# Altium project PCB_Project.PrjPcb (part 5 of 5)
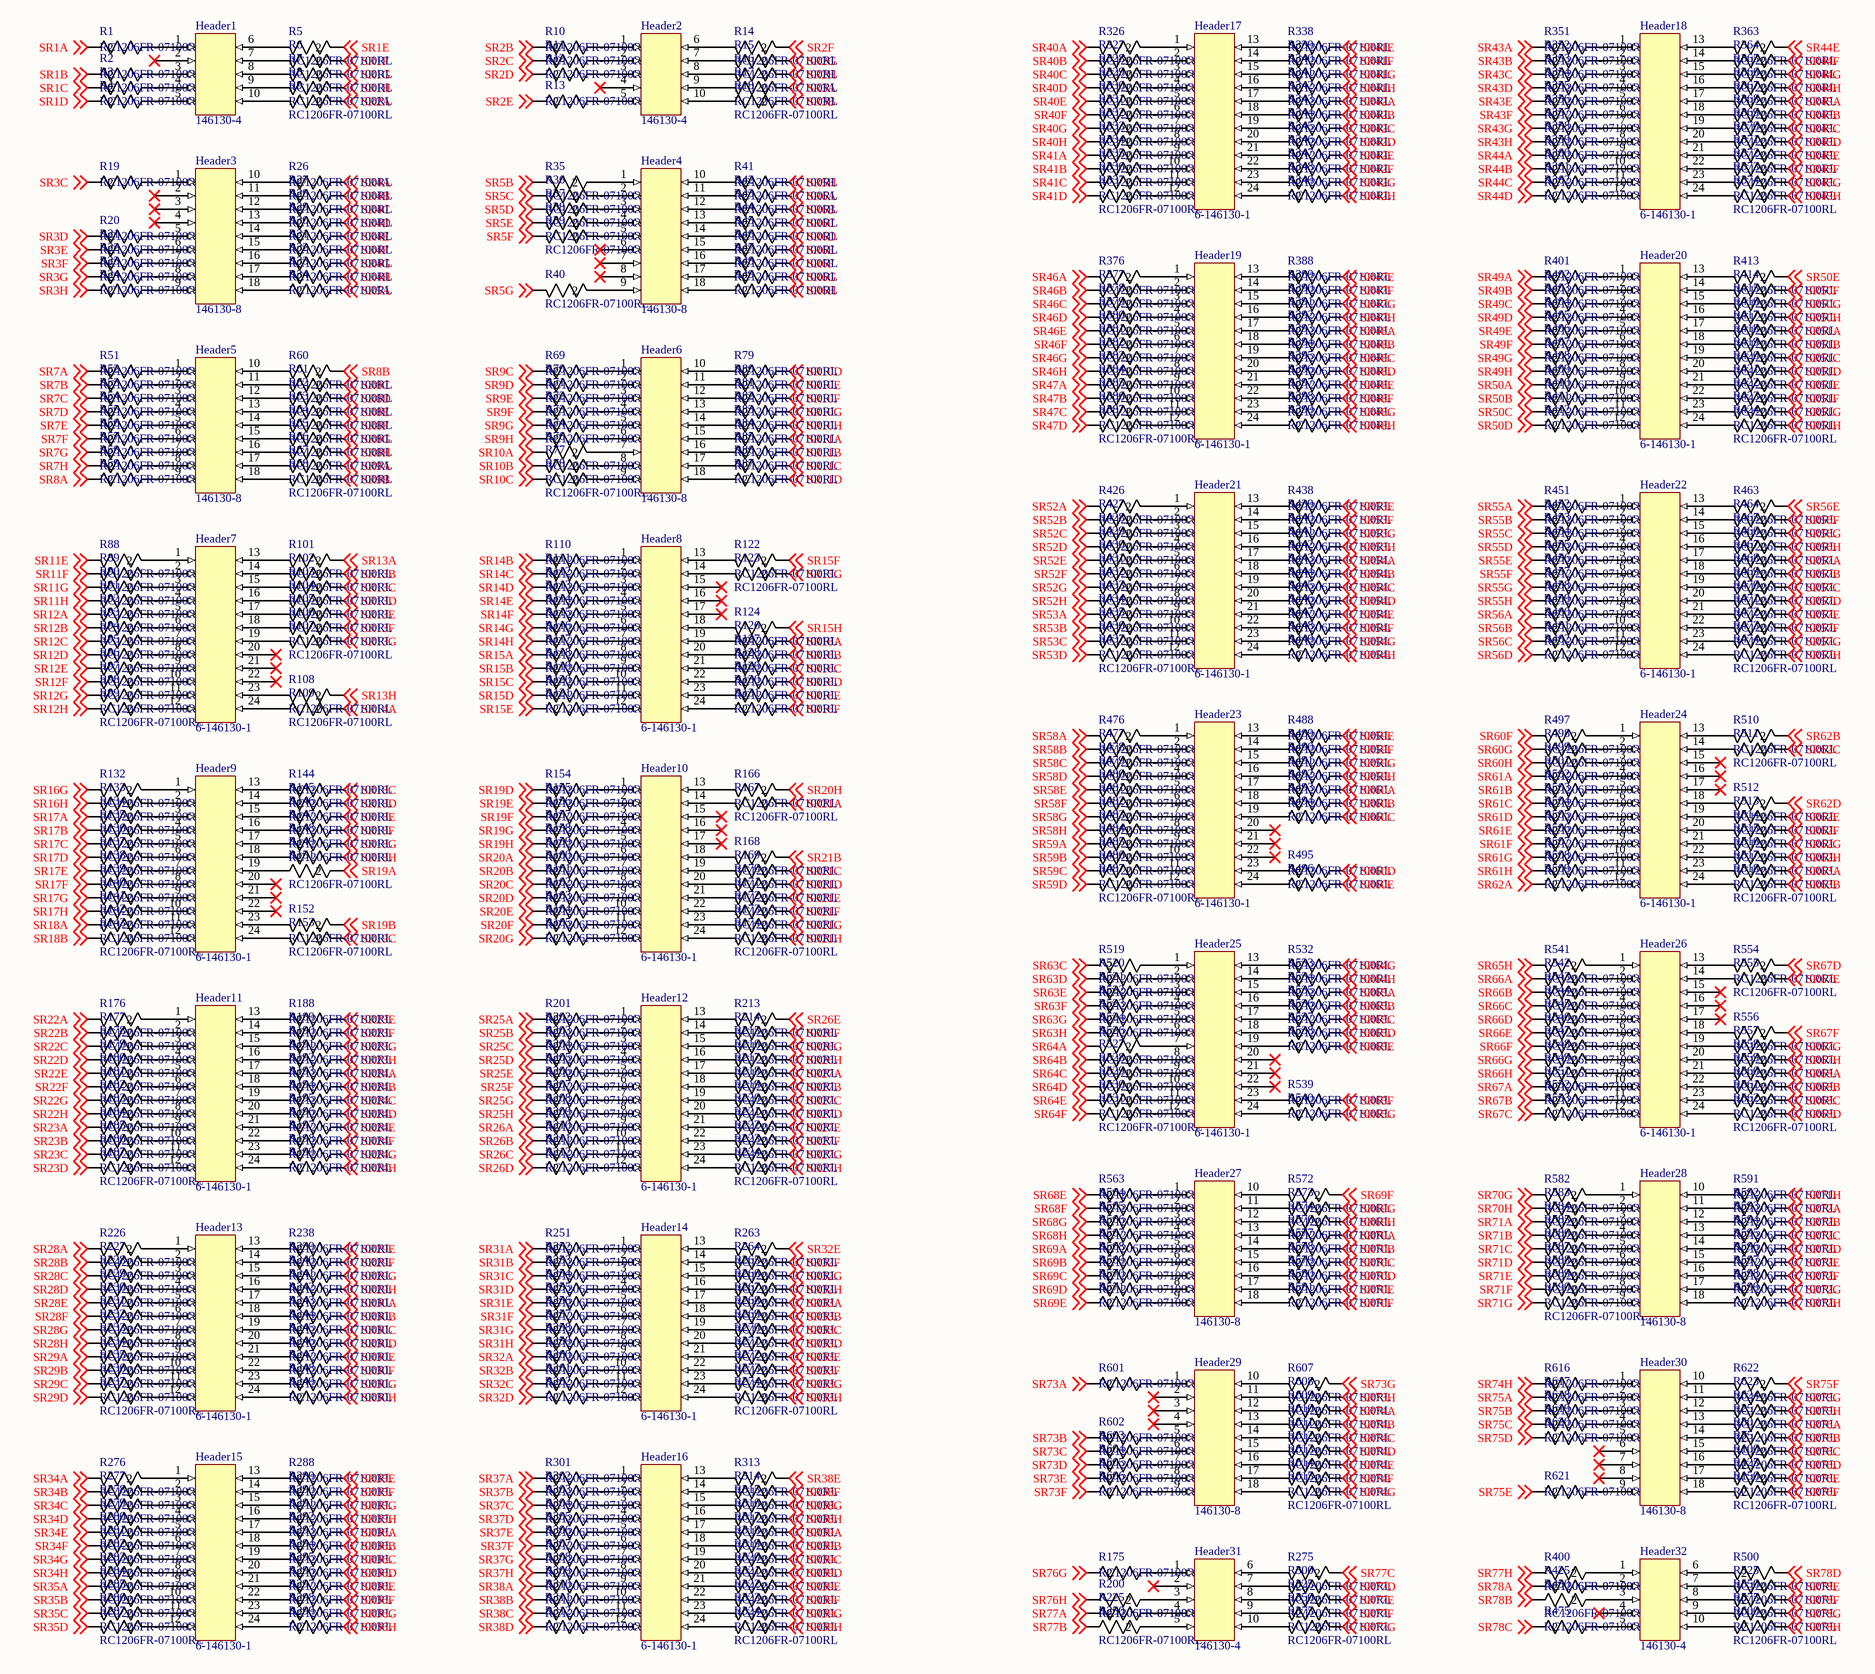
[diagram p10: digital_PIN_interface.SchDoc]

## Nets that join several sheets
SR1A: main (SER1.15), digital_PIN_interface (R1.2)
SR1B: main (SER1.1), digital_PIN_interface (R2.2)
SR1C: main (SER1.2), digital_PIN_interface (R3.2)
SR1D: main (SER1.3), digital_PIN_interface (R4.2)
SR1E: main (SER1.4), digital_PIN_interface (R5.2)
SR1F: main (SER1.5), digital_PIN_interface (R6.2)
SR1G: main (SER1.6), digital_PIN_interface (R7.2)
SR1H: main (SER1.7), digital_PIN_interface (R8.2)
SR2A: main (SER2.15), digital_PIN_interface (R9.2)
SR2B: main (SER2.1), digital_PIN_interface (R10.2)
SR2C: main (SER2.2), digital_PIN_interface (R11.2)
SR2D: main (SER2.3), digital_PIN_interface (R12.2)
SR2E: main (SER2.4), digital_PIN_interface (R13.2)
SR2F: main (SER2.5), digital_PIN_interface (R14.2)
SR2G: main (SER2.6), digital_PIN_interface (R15.2)
SR2H: main (SER2.7), digital_PIN_interface (R16.2)
SR3A: main (SER3.15), digital_PIN_interface (R17.2)
SR3B: main (SER3.1), digital_PIN_interface (R18.2)
SR3C: main (SER3.2), digital_PIN_interface (R19.2)
SR3D: main (SER3.3), digital_PIN_interface (R20.2)
SR3E: main (SER3.4), digital_PIN_interface (R21.2)
SR3F: main (SER3.5), digital_PIN_interface (R22.2)
SR3G: main (SER3.6), digital_PIN_interface (R23.2)
SR3H: main (SER3.7), digital_PIN_interface (R24.2)
SR4A: main (SER4.15), digital_PIN_interface (R26.1)
SR4B: main (SER4.1), digital_PIN_interface (R27.1)
SR4C: main (SER4.2), digital_PIN_interface (R28.1)
SR4D: main (SER4.3), digital_PIN_interface (R29.1)
SR4E: main (SER4.4), digital_PIN_interface (R30.1)
SR4F: main (SER4.5), digital_PIN_interface (R31.1)
SR4G: main (SER4.6), digital_PIN_interface (R32.1)
SR4H: main (SER4.7), digital_PIN_interface (R33.1)
SR5A: main (SER5.15), digital_PIN_interface (R34.1)
SR5B: main (SER5.1), digital_PIN_interface (R35.1)
SR5C: main (SER5.2), digital_PIN_interface (R36.1)
SR5D: main (SER5.3), digital_PIN_interface (R37.1)
SR5E: main (SER5.4), digital_PIN_interface (R38.1)
SR5F: main (SER5.5), digital_PIN_interface (R39.1)
SR5G: main (SER5.6), digital_PIN_interface (R40.1)
SR5H: main (SER5.7), digital_PIN_interface (R41.1)
SR6A: main (SER6.15), digital_PIN_interface (R42.1)
SR6B: main (SER6.1), digital_PIN_interface (R43.1)
SR6C: main (SER6.2), digital_PIN_interface (R44.1)
SR6D: main (SER6.3), digital_PIN_interface (R45.1)
SR6E: main (SER6.4), digital_PIN_interface (R46.1)
SR6F: main (SER6.5), digital_PIN_interface (R47.1)
SR6G: main (SER6.6), digital_PIN_interface (R48.1)
SR6H: main (SER6.7), digital_PIN_interface (R49.1)
SR7A: main (SER7.15), digital_PIN_interface (R51.2)
SR7B: main (SER7.1), digital_PIN_interface (R52.2)
SR7C: main (SER7.2), digital_PIN_interface (R53.2)
SR7D: main (SER7.3), digital_PIN_interface (R54.2)
SR7E: main (SER7.4), digital_PIN_interface (R55.2)
SR7F: main (SER7.5), digital_PIN_interface (R56.2)
SR7G: main (SER7.6), digital_PIN_interface (R57.2)
SR7H: main (SER7.7), digital_PIN_interface (R58.2)
SR8A: main (SER8.15), digital_PIN_interface (R59.2)
SR8B: main (SER8.1), digital_PIN_interface (R60.2)
SR8C: main (SER8.2), digital_PIN_interface (R61.2)
SR8D: main (SER8.3), digital_PIN_interface (R62.2)
SR8E: main (SER8.4), digital_PIN_interface (R63.2)
SR8F: main (SER8.5), digital_PIN_interface (R64.2)
SR8G: main (SER8.6), digital_PIN_interface (R65.2)
SR8H: main (SER8.7), digital_PIN_interface (R66.2)
SR9A: main (SER9.15), digital_PIN_interface (R67.2)
SR9B: main (SER9.1), digital_PIN_interface (R68.2)
SR9C: main (SER9.2), digital_PIN_interface (R69.2)
SR9D: main (SER9.3), digital_PIN_interface (R70.2)
SR9E: main (SER9.4), digital_PIN_interface (R71.2)
SR9F: main (SER9.5), digital_PIN_interface (R72.2)
SR9G: main (SER9.6), digital_PIN_interface (R73.2)
SR9H: main (SER9.7), digital_PIN_interface (R74.2)
SR10A: main (SER10.15), digital_PIN_interface (R76.1)
SR10B: main (SER10.1), digital_PIN_interface (R77.1)
SR10C: main (SER10.2), digital_PIN_interface (R78.1)
SR10D: main (SER10.3), digital_PIN_interface (R79.1)
SR10E: main (SER10.4), digital_PIN_interface (R80.1)
SR10F: main (SER10.5), digital_PIN_interface (R81.1)
SR10G: main (SER10.6), digital_PIN_interface (R82.1)
SR10H: main (SER10.7), digital_PIN_interface (R83.1)
SR11A: main (SER11.15), digital_PIN_interface (R84.1)
SR11B: main (SER11.1), digital_PIN_interface (R85.1)
SR11C: main (SER11.2), digital_PIN_interface (R86.1)
SR11D: main (SER11.3), digital_PIN_interface (R87.1)
SR11E: main (SER11.4), digital_PIN_interface (R88.1)
SR11F: main (SER11.5), digital_PIN_interface (R89.1)
SR11G: main (SER11.6), digital_PIN_interface (R90.1)
SR11H: main (SER11.7), digital_PIN_interface (R91.1)
SR12A: main (SER12.15), digital_PIN_interface (R92.1)
SR12B: main (SER12.1), digital_PIN_interface (R93.1)
SR12C: main (SER12.2), digital_PIN_interface (R94.1)
SR12D: main (SER12.3), digital_PIN_interface (R95.1)
SR12E: main (SER12.4), digital_PIN_interface (R96.1)
SR12F: main (SER12.5), digital_PIN_interface (R97.1)
SR12G: main (SER12.6), digital_PIN_interface (R98.1)
SR12H: main (SER12.7), digital_PIN_interface (R99.1)
SR13A: main (SER13.15), digital_PIN_interface (R101.2)
SR13B: main (SER13.1), digital_PIN_interface (R102.2)
SR13C: main (SER13.2), digital_PIN_interface (R103.2)
SR13D: main (SER13.3), digital_PIN_interface (R104.2)
SR13E: main (SER13.4), digital_PIN_interface (R105.2)
SR13F: main (SER13.5), digital_PIN_interface (R106.2)
SR13G: main (SER13.6), digital_PIN_interface (R107.2)
SR13H: main (SER13.7), digital_PIN_interface (R108.2)
SR14A: main (SER14.15), digital_PIN_interface (R109.2)
SR14B: main (SER14.1), digital_PIN_interface (R110.2)
SR14C: main (SER14.2), digital_PIN_interface (R111.2)
SR14D: main (SER14.3), digital_PIN_interface (R112.2)
SR14E: main (SER14.4), digital_PIN_interface (R113.2)
SR14F: main (SER14.5), digital_PIN_interface (R114.2)
SR14G: main (SER14.6), digital_PIN_interface (R115.2)
SR14H: main (SER14.7), digital_PIN_interface (R116.2)
SR15A: main (SER15.15), digital_PIN_interface (R117.2)
SR15B: main (SER15.1), digital_PIN_interface (R118.2)
SR15C: main (SER15.2), digital_PIN_interface (R119.2)
SR15D: main (SER15.3), digital_PIN_interface (R120.2)
SR15E: main (SER15.4), digital_PIN_interface (R121.2)
SR15F: main (SER15.5), digital_PIN_interface (R122.2)
SR15G: main (SER15.6), digital_PIN_interface (R123.2)
SR15H: main (SER15.7), digital_PIN_interface (R124.2)
SR16A: main (SER16.15), digital_PIN_interface (R126.1)
SR16B: main (SER16.1), digital_PIN_interface (R127.1)
SR16C: main (SER16.2), digital_PIN_interface (R128.1)
SR16D: main (SER16.3), digital_PIN_interface (R129.1)
SR16E: main (SER16.4), digital_PIN_interface (R130.1)
SR16F: main (SER16.5), digital_PIN_interface (R131.1)
SR16G: main (SER16.6), digital_PIN_interface (R132.1)
SR16H: main (SER16.7), digital_PIN_interface (R133.1)
SR17A: main (SER17.15), digital_PIN_interface (R134.1)
SR17B: main (SER17.1), digital_PIN_interface (R135.1)
SR17C: main (SER17.2), digital_PIN_interface (R136.1)
SR17D: main (SER17.3), digital_PIN_interface (R137.1)
SR17E: main (SER17.4), digital_PIN_interface (R138.1)
SR17F: main (SER17.5), digital_PIN_interface (R139.1)
SR17G: main (SER17.6), digital_PIN_interface (R140.1)
SR17H: main (SER17.7), digital_PIN_interface (R141.1)
SR18A: main (SER18.15), digital_PIN_interface (R142.1)
SR18B: main (SER18.1), digital_PIN_interface (R143.1)
SR18C: main (SER18.2), digital_PIN_interface (R144.1)
SR18D: main (SER18.3), digital_PIN_interface (R145.1)
SR18E: main (SER18.4), digital_PIN_interface (R146.1)
SR18F: main (SER18.5), digital_PIN_interface (R147.1)
SR18G: main (SER18.6), digital_PIN_interface (R148.1)
SR18H: main (SER18.7), digital_PIN_interface (R149.1)
SR19A: main (SER19.15), digital_PIN_interface (R151.2)
SR19B: main (SER19.1), digital_PIN_interface (R152.2)
SR19C: main (SER19.2), digital_PIN_interface (R153.2)
SR19D: main (SER19.3), digital_PIN_interface (R154.2)
SR19E: main (SER19.4), digital_PIN_interface (R155.2)
SR19F: main (SER19.5), digital_PIN_interface (R156.2)
SR19G: main (SER19.6), digital_PIN_interface (R157.2)
SR19H: main (SER19.7), digital_PIN_interface (R158.2)
SR20A: main (SER20.15), digital_PIN_interface (R159.2)
SR20B: main (SER20.1), digital_PIN_interface (R160.2)
SR20C: main (SER20.2), digital_PIN_interface (R161.2)
SR20D: main (SER20.3), digital_PIN_interface (R162.2)
SR20E: main (SER20.4), digital_PIN_interface (R163.2)
SR20F: main (SER20.5), digital_PIN_interface (R164.2)
SR20G: main (SER20.6), digital_PIN_interface (R165.2)
SR20H: main (SER20.7), digital_PIN_interface (R166.2)
SR21A: main (SER21.15), digital_PIN_interface (R167.2)
SR21B: main (SER21.1), digital_PIN_interface (R168.2)
SR21C: main (SER21.2), digital_PIN_interface (R169.2)
SR21D: main (SER21.3), digital_PIN_interface (R170.2)
SR21E: main (SER21.4), digital_PIN_interface (R171.2)
SR21F: main (SER21.5), digital_PIN_interface (R172.2)
SR21G: main (SER21.6), digital_PIN_interface (R173.2)
SR21H: main (SER21.7), digital_PIN_interface (R174.2)
SR22A: main (SER22.15), digital_PIN_interface (R176.1)
SR22B: main (SER22.1), digital_PIN_interface (R177.1)
SR22C: main (SER22.2), digital_PIN_interface (R178.1)
SR22D: main (SER22.3), digital_PIN_interface (R179.1)
SR22E: main (SER22.4), digital_PIN_interface (R180.1)
SR22F: main (SER22.5), digital_PIN_interface (R181.1)
SR22G: main (SER22.6), digital_PIN_interface (R182.1)
SR22H: main (SER22.7), digital_PIN_interface (R183.1)
SR23A: main (SER23.15), digital_PIN_interface (R184.1)
SR23B: main (SER23.1), digital_PIN_interface (R185.1)
SR23C: main (SER23.2), digital_PIN_interface (R186.1)
SR23D: main (SER23.3), digital_PIN_interface (R187.1)
SR23E: main (SER23.4), digital_PIN_interface (R188.1)
SR23F: main (SER23.5), digital_PIN_interface (R189.1)
SR23G: main (SER23.6), digital_PIN_interface (R190.1)
SR23H: main (SER23.7), digital_PIN_interface (R191.1)
SR24A: main (SER24.15), digital_PIN_interface (R192.1)
SR24B: main (SER24.1), digital_PIN_interface (R193.1)
SR24C: main (SER24.2), digital_PIN_interface (R194.1)
SR24D: main (SER24.3), digital_PIN_interface (R195.1)
SR24E: main (SER24.4), digital_PIN_interface (R196.1)
SR24F: main (SER24.5), digital_PIN_interface (R197.1)
SR24G: main (SER24.6), digital_PIN_interface (R198.1)
SR24H: main (SER24.7), digital_PIN_interface (R199.1)
SR25A: main (SER25.15), digital_PIN_interface (R201.2)
SR25B: main (SER25.1), digital_PIN_interface (R202.2)
SR25C: main (SER25.2), digital_PIN_interface (R203.2)
SR25D: main (SER25.3), digital_PIN_interface (R204.2)
SR25E: main (SER25.4), digital_PIN_interface (R205.2)
SR25F: main (SER25.5), digital_PIN_interface (R206.2)
SR25G: main (SER25.6), digital_PIN_interface (R207.2)
SR25H: main (SER25.7), digital_PIN_interface (R208.2)
SR26A: main (SER26.15), digital_PIN_interface (R209.2)
SR26B: main (SER26.1), digital_PIN_interface (R210.2)
SR26C: main (SER26.2), digital_PIN_interface (R211.2)
SR26D: main (SER26.3), digital_PIN_interface (R212.2)
SR26E: main (SER26.4), digital_PIN_interface (R213.2)
SR26F: main (SER26.5), digital_PIN_interface (R214.2)
SR26G: main (SER26.6), digital_PIN_interface (R215.2)
SR26H: main (SER26.7), digital_PIN_interface (R216.2)
SR27A: main (SER27.15), digital_PIN_interface (R217.2)
SR27B: main (SER27.1), digital_PIN_interface (R218.2)
SR27C: main (SER27.2), digital_PIN_interface (R219.2)
SR27D: main (SER27.3), digital_PIN_interface (R220.2)
SR27E: main (SER27.4), digital_PIN_interface (R221.2)
SR27F: main (SER27.5), digital_PIN_interface (R222.2)
SR27G: main (SER27.6), digital_PIN_interface (R223.2)
SR27H: main (SER27.7), digital_PIN_interface (R224.2)
SR28A: main (SER28.15), digital_PIN_interface (R226.1)
SR28B: main (SER28.1), digital_PIN_interface (R227.1)
SR28C: main (SER28.2), digital_PIN_interface (R228.1)
SR28D: main (SER28.3), digital_PIN_interface (R229.1)
SR28E: main (SER28.4), digital_PIN_interface (R230.1)
SR28F: main (SER28.5), digital_PIN_interface (R231.1)
SR28G: main (SER28.6), digital_PIN_interface (R232.1)
SR28H: main (SER28.7), digital_PIN_interface (R233.1)
SR29A: main (SER29.15), digital_PIN_interface (R234.1)
SR29B: main (SER29.1), digital_PIN_interface (R235.1)
SR29C: main (SER29.2), digital_PIN_interface (R236.1)
SR29D: main (SER29.3), digital_PIN_interface (R237.1)
SR29E: main (SER29.4), digital_PIN_interface (R238.1)
SR29F: main (SER29.5), digital_PIN_interface (R239.1)
SR29G: main (SER29.6), digital_PIN_interface (R240.1)
SR29H: main (SER29.7), digital_PIN_interface (R241.1)
SR30A: main (SER30.15), digital_PIN_interface (R242.1)
SR30B: main (SER30.1), digital_PIN_interface (R243.1)
SR30C: main (SER30.2), digital_PIN_interface (R244.1)
SR30D: main (SER30.3), digital_PIN_interface (R245.1)
SR30E: main (SER30.4), digital_PIN_interface (R246.1)
SR30F: main (SER30.5), digital_PIN_interface (R247.1)
SR30G: main (SER30.6), digital_PIN_interface (R248.1)
SR30H: main (SER30.7), digital_PIN_interface (R249.1)
SR31A: main (SER31.15), digital_PIN_interface (R251.2)
SR31B: main (SER31.1), digital_PIN_interface (R252.2)
SR31C: main (SER31.2), digital_PIN_interface (R253.2)
SR31D: main (SER31.3), digital_PIN_interface (R254.2)
SR31E: main (SER31.4), digital_PIN_interface (R255.2)
SR31F: main (SER31.5), digital_PIN_interface (R256.2)
SR31G: main (SER31.6), digital_PIN_interface (R257.2)
SR31H: main (SER31.7), digital_PIN_interface (R258.2)
SR32A: main (SER32.15), digital_PIN_interface (R259.2)
SR32B: main (SER32.1), digital_PIN_interface (R260.2)
SR32C: main (SER32.2), digital_PIN_interface (R261.2)
SR32D: main (SER32.3), digital_PIN_interface (R262.2)
SR32E: main (SER32.4), digital_PIN_interface (R263.2)
SR32F: main (SER32.5), digital_PIN_interface (R264.2)
SR32G: main (SER32.6), digital_PIN_interface (R265.2)
SR32H: main (SER32.7), digital_PIN_interface (R266.2)
SR33A: main (SER33.15), digital_PIN_interface (R267.2)
SR33B: main (SER33.1), digital_PIN_interface (R268.2)
SR33C: main (SER33.2), digital_PIN_interface (R269.2)
SR33D: main (SER33.3), digital_PIN_interface (R270.2)
SR33E: main (SER33.4), digital_PIN_interface (R271.2)
SR33F: main (SER33.5), digital_PIN_interface (R272.2)
SR33G: main (SER33.6), digital_PIN_interface (R273.2)
SR33H: main (SER33.7), digital_PIN_interface (R274.2)
SR34A: main (SER34.15), digital_PIN_interface (R276.1)
SR34B: main (SER34.1), digital_PIN_interface (R277.1)
SR34C: main (SER34.2), digital_PIN_interface (R278.1)
SR34D: main (SER34.3), digital_PIN_interface (R279.1)
SR34E: main (SER34.4), digital_PIN_interface (R280.1)
SR34F: main (SER34.5), digital_PIN_interface (R281.1)
SR34G: main (SER34.6), digital_PIN_interface (R282.1)
SR34H: main (SER34.7), digital_PIN_interface (R283.1)
SR35A: main (SER35.15), digital_PIN_interface (R284.1)
SR35B: main (SER35.1), digital_PIN_interface (R285.1)
SR35C: main (SER35.2), digital_PIN_interface (R286.1)
SR35D: main (SER35.3), digital_PIN_interface (R287.1)
SR35E: main (SER35.4), digital_PIN_interface (R288.1)
SR35F: main (SER35.5), digital_PIN_interface (R289.1)
SR35G: main (SER35.6), digital_PIN_interface (R290.1)
SR35H: main (SER35.7), digital_PIN_interface (R291.1)
SR36A: main (SER36.15), digital_PIN_interface (R292.1)
SR36B: main (SER36.1), digital_PIN_interface (R293.1)
SR36C: main (SER36.2), digital_PIN_interface (R294.1)
SR36D: main (SER36.3), digital_PIN_interface (R295.1)
SR36E: main (SER36.4), digital_PIN_interface (R296.1)
SR36F: main (SER36.5), digital_PIN_interface (R297.1)
SR36G: main (SER36.6), digital_PIN_interface (R298.1)
SR36H: main (SER36.7), digital_PIN_interface (R299.1)
SR37A: main (SER37.15), digital_PIN_interface (R301.2)
SR37B: main (SER37.1), digital_PIN_interface (R302.2)
SR37C: main (SER37.2), digital_PIN_interface (R303.2)
SR37D: main (SER37.3), digital_PIN_interface (R304.2)
SR37E: main (SER37.4), digital_PIN_interface (R305.2)
SR37F: main (SER37.5), digital_PIN_interface (R306.2)
SR37G: main (SER37.6), digital_PIN_interface (R307.2)
SR37H: main (SER37.7), digital_PIN_interface (R308.2)
SR38A: main (SER38.15), digital_PIN_interface (R309.2)
SR38B: main (SER38.1), digital_PIN_interface (R310.2)
SR38C: main (SER38.2), digital_PIN_interface (R311.2)
SR38D: main (SER38.3), digital_PIN_interface (R312.2)
SR38E: main (SER38.4), digital_PIN_interface (R313.2)
SR38F: main (SER38.5), digital_PIN_interface (R314.2)
SR38G: main (SER38.6), digital_PIN_interface (R315.2)
SR38H: main (SER38.7), digital_PIN_interface (R316.2)
SR39A: main (SER39.15), digital_PIN_interface (R317.2)
SR39B: main (SER39.1), digital_PIN_interface (R318.2)
SR39C: main (SER39.2), digital_PIN_interface (R319.2)
SR39D: main (SER39.3), digital_PIN_interface (R320.2)
SR39E: main (SER39.4), digital_PIN_interface (R321.2)
SR39F: main (SER39.5), digital_PIN_interface (R322.2)
SR39G: main (SER39.6), digital_PIN_interface (R323.2)
SR39H: main (SER39.7), digital_PIN_interface (R324.2)
SR40A: main (SER40.15), digital_PIN_interface (R326.1)
SR40B: main (SER40.1), digital_PIN_interface (R327.1)
SR40C: main (SER40.2), digital_PIN_interface (R328.1)
SR40D: main (SER40.3), digital_PIN_interface (R329.1)
SR40E: main (SER40.4), digital_PIN_interface (R330.1)
SR40F: main (SER40.5), digital_PIN_interface (R331.1)
SR40G: main (SER40.6), digital_PIN_interface (R332.1)
SR40H: main (SER40.7), digital_PIN_interface (R333.1)
SR41A: main (SER41.15), digital_PIN_interface (R334.1)
SR41B: main (SER41.1), digital_PIN_interface (R335.1)
SR41C: main (SER41.2), digital_PIN_interface (R336.1)
SR41D: main (SER41.3), digital_PIN_interface (R337.1)
SR41E: main (SER41.4), digital_PIN_interface (R338.1)
SR41F: main (SER41.5), digital_PIN_interface (R339.1)
SR41G: main (SER41.6), digital_PIN_interface (R340.1)
SR41H: main (SER41.7), digital_PIN_interface (R341.1)
SR42A: main (SER42.15), digital_PIN_interface (R342.1)
SR42B: main (SER42.1), digital_PIN_interface (R343.1)
SR42C: main (SER42.2), digital_PIN_interface (R344.1)
SR42D: main (SER42.3), digital_PIN_interface (R345.1)
SR42E: main (SER42.4), digital_PIN_interface (R346.1)
SR42F: main (SER42.5), digital_PIN_interface (R347.1)
SR42G: main (SER42.6), digital_PIN_interface (R348.1)
SR42H: main (SER42.7), digital_PIN_interface (R349.1)
SR43A: main (SER43.15), digital_PIN_interface (R351.2)
SR43B: main (SER43.1), digital_PIN_interface (R352.2)
SR43C: main (SER43.2), digital_PIN_interface (R353.2)
SR43D: main (SER43.3), digital_PIN_interface (R354.2)
SR43E: main (SER43.4), digital_PIN_interface (R355.2)
SR43F: main (SER43.5), digital_PIN_interface (R356.2)
SR43G: main (SER43.6), digital_PIN_interface (R357.2)
SR43H: main (SER43.7), digital_PIN_interface (R358.2)
SR44A: main (SER44.15), digital_PIN_interface (R359.2)
SR44B: main (SER44.1), digital_PIN_interface (R360.2)
SR44C: main (SER44.2), digital_PIN_interface (R361.2)
SR44D: main (SER44.3), digital_PIN_interface (R362.2)
SR44E: main (SER44.4), digital_PIN_interface (R363.2)
SR44F: main (SER44.5), digital_PIN_interface (R364.2)
SR44G: main (SER44.6), digital_PIN_interface (R365.2)
SR44H: main (SER44.7), digital_PIN_interface (R366.2)
SR45A: main (SER45.15), digital_PIN_interface (R367.2)
SR45B: main (SER45.1), digital_PIN_interface (R368.2)
SR45C: main (SER45.2), digital_PIN_interface (R369.2)
SR45D: main (SER45.3), digital_PIN_interface (R370.2)
SR45E: main (SER45.4), digital_PIN_interface (R371.2)
SR45F: main (SER45.5), digital_PIN_interface (R372.2)
SR45G: main (SER45.6), digital_PIN_interface (R373.2)
SR45H: main (SER45.7), digital_PIN_interface (R374.2)
SR46A: main (SER46.15), digital_PIN_interface (R376.1)
SR46B: main (SER46.1), digital_PIN_interface (R377.1)
SR46C: main (SER46.2), digital_PIN_interface (R378.1)
SR46D: main (SER46.3), digital_PIN_interface (R379.1)
SR46E: main (SER46.4), digital_PIN_interface (R380.1)
SR46F: main (SER46.5), digital_PIN_interface (R381.1)
SR46G: main (SER46.6), digital_PIN_interface (R382.1)
SR46H: main (SER46.7), digital_PIN_interface (R383.1)
SR47A: main (SER47.15), digital_PIN_interface (R384.1)
SR47B: main (SER47.1), digital_PIN_interface (R385.1)
SR47C: main (SER47.2), digital_PIN_interface (R386.1)
SR47D: main (SER47.3), digital_PIN_interface (R387.1)
SR47E: main (SER47.4), digital_PIN_interface (R388.1)
SR47F: main (SER47.5), digital_PIN_interface (R389.1)
SR47G: main (SER47.6), digital_PIN_interface (R390.1)
SR47H: main (SER47.7), digital_PIN_interface (R391.1)
SR48A: main (SER48.15), digital_PIN_interface (R392.1)
SR48B: main (SER48.1), digital_PIN_interface (R393.1)
SR48C: main (SER48.2), digital_PIN_interface (R394.1)
SR48D: main (SER48.3), digital_PIN_interface (R395.1)
SR48E: main (SER48.4), digital_PIN_interface (R396.1)
SR48F: main (SER48.5), digital_PIN_interface (R397.1)
SR48G: main (SER48.6), digital_PIN_interface (R398.1)
SR48H: main (SER48.7), digital_PIN_interface (R399.1)
SR49A: main (SER49.15), digital_PIN_interface (R401.2)
SR49B: main (SER49.1), digital_PIN_interface (R402.2)
SR49C: main (SER49.2), digital_PIN_interface (R403.2)
SR49D: main (SER49.3), digital_PIN_interface (R404.2)
SR49E: main (SER49.4), digital_PIN_interface (R405.2)
SR49F: main (SER49.5), digital_PIN_interface (R406.2)
SR49G: main (SER49.6), digital_PIN_interface (R407.2)
SR49H: main (SER49.7), digital_PIN_interface (R408.2)
SR50A: main (SER50.15), digital_PIN_interface (R409.2)
SR50B: main (SER50.1), digital_PIN_interface (R410.2)
SR50C: main (SER50.2), digital_PIN_interface (R411.2)
SR50D: main (SER50.3), digital_PIN_interface (R412.2)
SR50E: main (SER50.4), digital_PIN_interface (R413.2)
SR50F: main (SER50.5), digital_PIN_interface (R414.2)
SR50G: main (SER50.6), digital_PIN_interface (R415.2)
SR50H: main (SER50.7), digital_PIN_interface (R416.2)
SR51A: main (SER51.15), digital_PIN_interface (R417.2)
SR51B: main (SER51.1), digital_PIN_interface (R418.2)
SR51C: main (SER51.2), digital_PIN_interface (R419.2)
SR51D: main (SER51.3), digital_PIN_interface (R420.2)
SR51E: main (SER51.4), digital_PIN_interface (R421.2)
SR51F: main (SER51.5), digital_PIN_interface (R422.2)
SR51G: main (SER51.6), digital_PIN_interface (R423.2)
SR51H: main (SER51.7), digital_PIN_interface (R424.2)
SR52A: main (SER52.15), digital_PIN_interface (R426.1)
SR52B: main (SER52.1), digital_PIN_interface (R427.1)
SR52C: main (SER52.2), digital_PIN_interface (R428.1)
SR52D: main (SER52.3), digital_PIN_interface (R429.1)
SR52E: main (SER52.4), digital_PIN_interface (R430.1)
SR52F: main (SER52.5), digital_PIN_interface (R431.1)
SR52G: main (SER52.6), digital_PIN_interface (R432.1)
SR52H: main (SER52.7), digital_PIN_interface (R433.1)
SR53A: main (SER53.15), digital_PIN_interface (R434.1)
SR53B: main (SER53.1), digital_PIN_interface (R435.1)
SR53C: main (SER53.2), digital_PIN_interface (R436.1)
SR53D: main (SER53.3), digital_PIN_interface (R437.1)
SR53E: main (SER53.4), digital_PIN_interface (R438.1)
SR53F: main (SER53.5), digital_PIN_interface (R439.1)
SR53G: main (SER53.6), digital_PIN_interface (R440.1)
SR53H: main (SER53.7), digital_PIN_interface (R441.1)
SR54A: main (SER54.15), digital_PIN_interface (R442.1)
SR54B: main (SER54.1), digital_PIN_interface (R443.1)
SR54C: main (SER54.2), digital_PIN_interface (R444.1)
SR54D: main (SER54.3), digital_PIN_interface (R445.1)
SR54E: main (SER54.4), digital_PIN_interface (R446.1)
SR54F: main (SER54.5), digital_PIN_interface (R447.1)
SR54G: main (SER54.6), digital_PIN_interface (R448.1)
SR54H: main (SER54.7), digital_PIN_interface (R449.1)
SR55A: main (SER55.15), digital_PIN_interface (R451.2)
SR55B: main (SER55.1), digital_PIN_interface (R452.2)
SR55C: main (SER55.2), digital_PIN_interface (R453.2)
SR55D: main (SER55.3), digital_PIN_interface (R454.2)
SR55E: main (SER55.4), digital_PIN_interface (R455.2)
SR55F: main (SER55.5), digital_PIN_interface (R456.2)
SR55G: main (SER55.6), digital_PIN_interface (R457.2)
SR55H: main (SER55.7), digital_PIN_interface (R458.2)
SR56A: main (SER56.15), digital_PIN_interface (R459.2)
SR56B: main (SER56.1), digital_PIN_interface (R460.2)
SR56C: main (SER56.2), digital_PIN_interface (R461.2)
SR56D: main (SER56.3), digital_PIN_interface (R462.2)
SR56E: main (SER56.4), digital_PIN_interface (R463.2)
SR56F: main (SER56.5), digital_PIN_interface (R464.2)
SR56G: main (SER56.6), digital_PIN_interface (R465.2)
SR56H: main (SER56.7), digital_PIN_interface (R466.2)
SR57A: main (SER57.15), digital_PIN_interface (R467.2)
SR57B: main (SER57.1), digital_PIN_interface (R468.2)
SR57C: main (SER57.2), digital_PIN_interface (R469.2)
SR57D: main (SER57.3), digital_PIN_interface (R470.2)
SR57E: main (SER57.4), digital_PIN_interface (R471.2)
SR57F: main (SER57.5), digital_PIN_interface (R472.2)
SR57G: main (SER57.6), digital_PIN_interface (R473.2)
SR57H: main (SER57.7), digital_PIN_interface (R474.2)
SR58A: main (SER58.15), digital_PIN_interface (R476.1)
SR58B: main (SER58.1), digital_PIN_interface (R477.1)
SR58C: main (SER58.2), digital_PIN_interface (R478.1)
SR58D: main (SER58.3), digital_PIN_interface (R479.1)
SR58E: main (SER58.4), digital_PIN_interface (R480.1)
SR58F: main (SER58.5), digital_PIN_interface (R481.1)
SR58G: main (SER58.6), digital_PIN_interface (R482.1)
SR58H: main (SER58.7), digital_PIN_interface (R483.1)
SR59A: main (SER59.15), digital_PIN_interface (R484.1)
SR59B: main (SER59.1), digital_PIN_interface (R485.1)
SR59C: main (SER59.2), digital_PIN_interface (R486.1)
SR59D: main (SER59.3), digital_PIN_interface (R487.1)
SR59E: main (SER59.4), digital_PIN_interface (R488.1)
SR59F: main (SER59.5), digital_PIN_interface (R489.1)
SR59G: main (SER59.6), digital_PIN_interface (R490.1)
SR59H: main (SER59.7), digital_PIN_interface (R491.1)
SR60A: main (SER60.15), digital_PIN_interface (R492.1)
SR60B: main (SER60.1), digital_PIN_interface (R493.1)
SR60C: main (SER60.2), digital_PIN_interface (R494.1)
SR60D: main (SER60.3), digital_PIN_interface (R495.1)
SR60E: main (SER60.4), digital_PIN_interface (R496.1)
SR60F: main (SER60.5), digital_PIN_interface (R497.1)
SR60G: main (SER60.6), digital_PIN_interface (R498.1)
SR60H: main (SER60.7), digital_PIN_interface (R499.1)
SR61A: main (SER61.15), digital_PIN_interface (R501.2)
SR61B: main (SER61.1), digital_PIN_interface (R502.2)
SR61C: main (SER61.2), digital_PIN_interface (R503.2)
SR61D: main (SER61.3), digital_PIN_interface (R504.2)
SR61E: main (SER61.4), digital_PIN_interface (R505.2)
SR61F: main (SER61.5), digital_PIN_interface (R506.2)
SR61G: main (SER61.6), digital_PIN_interface (R507.2)
SR61H: main (SER61.7), digital_PIN_interface (R508.2)
SR62A: main (SER62.15), digital_PIN_interface (R509.2)
SR62B: main (SER62.1), digital_PIN_interface (R510.2)
SR62C: main (SER62.2), digital_PIN_interface (R511.2)
SR62D: main (SER62.3), digital_PIN_interface (R512.2)
SR62E: main (SER62.4), digital_PIN_interface (R513.2)
SR62F: main (SER62.5), digital_PIN_interface (R514.2)
SR62G: main (SER62.6), digital_PIN_interface (R515.2)
SR62H: main (SER62.7), digital_PIN_interface (R516.2)
SR63A: main (SER63.15), digital_PIN_interface (R517.2)
SR63B: main (SER63.1), digital_PIN_interface (R518.2)
SR63C: main (SER63.2), digital_PIN_interface (R519.2)
SR63D: main (SER63.3), digital_PIN_interface (R520.2)
SR63E: main (SER63.4), digital_PIN_interface (R521.2)
SR63F: main (SER63.5), digital_PIN_interface (R522.2)
SR63G: main (SER63.6), digital_PIN_interface (R523.2)
SR63H: main (SER63.7), digital_PIN_interface (R524.2)
SR64A: main (SER64.15), digital_PIN_interface (R526.1)
SR64B: main (SER64.1), digital_PIN_interface (R527.1)
SR64C: main (SER64.2), digital_PIN_interface (R528.1)
SR64D: main (SER64.3), digital_PIN_interface (R529.1)
SR64E: main (SER64.4), digital_PIN_interface (R530.1)
SR64F: main (SER64.5), digital_PIN_interface (R531.1)
SR64G: main (SER64.6), digital_PIN_interface (R532.1)
SR64H: main (SER64.7), digital_PIN_interface (R533.1)
SR65A: main (SER65.15), digital_PIN_interface (R534.1)
SR65B: main (SER65.1), digital_PIN_interface (R535.1)
SR65C: main (SER65.2), digital_PIN_interface (R536.1)
SR65D: main (SER65.3), digital_PIN_interface (R537.1)
SR65E: main (SER65.4), digital_PIN_interface (R538.1)
SR65F: main (SER65.5), digital_PIN_interface (R539.1)
SR65G: main (SER65.6), digital_PIN_interface (R540.1)
SR65H: main (SER65.7), digital_PIN_interface (R541.1)
SR66A: main (SER66.15), digital_PIN_interface (R542.1)
SR66B: main (SER66.1), digital_PIN_interface (R543.1)
SR66C: main (SER66.2), digital_PIN_interface (R544.1)
SR66D: main (SER66.3), digital_PIN_interface (R545.1)
SR66E: main (SER66.4), digital_PIN_interface (R546.1)
SR66F: main (SER66.5), digital_PIN_interface (R547.1)
SR66G: main (SER66.6), digital_PIN_interface (R548.1)
SR66H: main (SER66.7), digital_PIN_interface (R549.1)
SR67A: main (SER67.15), digital_PIN_interface (R551.2)
SR67B: main (SER67.1), digital_PIN_interface (R552.2)
SR67C: main (SER67.2), digital_PIN_interface (R553.2)
SR67D: main (SER67.3), digital_PIN_interface (R554.2)
SR67E: main (SER67.4), digital_PIN_interface (R555.2)
SR67F: main (SER67.5), digital_PIN_interface (R556.2)
SR67G: main (SER67.6), digital_PIN_interface (R557.2)
SR67H: main (SER67.7), digital_PIN_interface (R558.2)
SR68A: main (SER68.15), digital_PIN_interface (R559.2)
SR68B: main (SER68.1), digital_PIN_interface (R560.2)
SR68C: main (SER68.2), digital_PIN_interface (R561.2)
SR68D: main (SER68.3), digital_PIN_interface (R562.2)
SR68E: main (SER68.4), digital_PIN_interface (R563.2)
SR68F: main (SER68.5), digital_PIN_interface (R564.2)
SR68G: main (SER68.6), digital_PIN_interface (R565.2)
SR68H: main (SER68.7), digital_PIN_interface (R566.2)
SR69A: main (SER69.15), digital_PIN_interface (R567.2)
SR69B: main (SER69.1), digital_PIN_interface (R568.2)
SR69C: main (SER69.2), digital_PIN_interface (R569.2)
SR69D: main (SER69.3), digital_PIN_interface (R570.2)
SR69E: main (SER69.4), digital_PIN_interface (R571.2)
SR69F: main (SER69.5), digital_PIN_interface (R572.2)
SR69G: main (SER69.6), digital_PIN_interface (R573.2)
SR69H: main (SER69.7), digital_PIN_interface (R574.2)
SR70A: main (SER70.15), digital_PIN_interface (R576.1)
SR70B: main (SER70.1), digital_PIN_interface (R577.1)
SR70C: main (SER70.2), digital_PIN_interface (R578.1)
SR70D: main (SER70.3), digital_PIN_interface (R579.1)
SR70E: main (SER70.4), digital_PIN_interface (R580.1)
SR70F: main (SER70.5), digital_PIN_interface (R581.1)
SR70G: main (SER70.6), digital_PIN_interface (R582.1)
SR70H: main (SER70.7), digital_PIN_interface (R583.1)
SR71A: main (SER71.15), digital_PIN_interface (R584.1)
SR71B: main (SER71.1), digital_PIN_interface (R585.1)
SR71C: main (SER71.2), digital_PIN_interface (R586.1)
SR71D: main (SER71.3), digital_PIN_interface (R587.1)
SR71E: main (SER71.4), digital_PIN_interface (R588.1)
SR71F: main (SER71.5), digital_PIN_interface (R589.1)
SR71G: main (SER71.6), digital_PIN_interface (R590.1)
SR71H: main (SER71.7), digital_PIN_interface (R591.1)
SR72A: main (SER72.15), digital_PIN_interface (R592.1)
SR72B: main (SER72.1), digital_PIN_interface (R593.1)
SR72C: main (SER72.2), digital_PIN_interface (R594.1)
SR72D: main (SER72.3), digital_PIN_interface (R595.1)
SR72E: main (SER72.4), digital_PIN_interface (R596.1)
SR72F: main (SER72.5), digital_PIN_interface (R597.1)
SR72G: main (SER72.6), digital_PIN_interface (R598.1)
SR72H: main (SER72.7), digital_PIN_interface (R599.1)
SR73A: main (SER73.15), digital_PIN_interface (R601.2)
SR73B: main (SER73.1), digital_PIN_interface (R602.2)
SR73C: main (SER73.2), digital_PIN_interface (R603.2)
SR73D: main (SER73.3), digital_PIN_interface (R604.2)
SR73E: main (SER73.4), digital_PIN_interface (R605.2)
SR73F: main (SER73.5), digital_PIN_interface (R606.2)
SR73G: main (SER73.6), digital_PIN_interface (R607.2)
SR73H: main (SER73.7), digital_PIN_interface (R608.2)
SR74A: main (SER74.15), digital_PIN_interface (R609.2)
SR74B: main (SER74.1), digital_PIN_interface (R610.2)
SR74C: main (SER74.2), digital_PIN_interface (R611.2)
SR74D: main (SER74.3), digital_PIN_interface (R612.2)
SR74E: main (SER74.4), digital_PIN_interface (R613.2)
SR74F: main (SER74.5), digital_PIN_interface (R614.2)
SR74G: main (SER74.6), digital_PIN_interface (R615.2)
SR74H: main (SER74.7), digital_PIN_interface (R616.2)
SR75A: main (SER75.15), digital_PIN_interface (R617.2)
SR75B: main (SER75.1), digital_PIN_interface (R618.2)
SR75C: main (SER75.2), digital_PIN_interface (R619.2)
SR75D: main (SER75.3), digital_PIN_interface (R620.2)
SR75E: main (SER75.4), digital_PIN_interface (R621.2)
SR75F: main (SER75.5), digital_PIN_interface (R622.2)
SR75G: main (SER75.6), digital_PIN_interface (R623.2)
SR75H: main (SER75.7), digital_PIN_interface (R624.2)
SR76A: main (SER76.15), digital_PIN_interface (R25.2)
SR76B: main (SER76.1), digital_PIN_interface (R50.1)
SR76C: main (SER76.2), digital_PIN_interface (R75.2)
SR76D: main (SER76.3), digital_PIN_interface (R100.1)
SR76E: main (SER76.4), digital_PIN_interface (R125.2)
SR76F: main (SER76.5), digital_PIN_interface (R150.1)
SR76G: main (SER76.6), digital_PIN_interface (R175.2)
SR76H: main (SER76.7), digital_PIN_interface (R200.1)
SR77A: main (SER77.15), digital_PIN_interface (R225.2)
SR77B: main (SER77.1), digital_PIN_interface (R250.1)
SR77C: main (SER77.2), digital_PIN_interface (R275.2)
SR77D: main (SER77.3), digital_PIN_interface (R300.1)
SR77E: main (SER77.4), digital_PIN_interface (R325.2)
SR77F: main (SER77.5), digital_PIN_interface (R350.1)
SR77G: main (SER77.6), digital_PIN_interface (R375.2)
SR77H: main (SER77.7), digital_PIN_interface (R400.1)
SR78A: main (SER78.15), digital_PIN_interface (R425.2)
SR78B: main (SER78.1), digital_PIN_interface (R450.1)
SR78C: main (SER78.2), digital_PIN_interface (R475.2)
SR78D: main (SER78.3), digital_PIN_interface (R500.1)
SR78E: main (SER78.4), digital_PIN_interface (R525.2)
SR78F: main (SER78.5), digital_PIN_interface (R550.1)
SR78G: main (SER78.6), digital_PIN_interface (R575.2)
SR78H: main (SER78.7), digital_PIN_interface (R600.1)